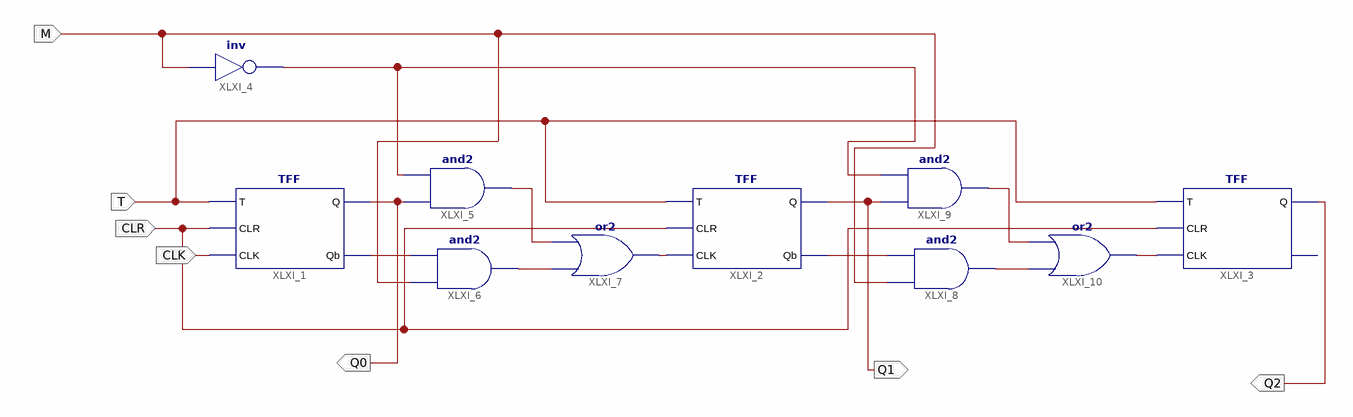
[diagram p0: schematic sheet 1]
// Xilinx ISE schematic Ripple_couner_up_down.sch (spartan3a) as structural Verilog: 10 symbols, 7 ports
module Ripple_couner_up_down (
  input  M,
  input  T,
  input  CLR,
  input  CLK,
  output Q0,
  output Q1,
  output Q2
);

  wire XLXN_5, XLXN_7, XLXN_8, XLXN_9, XLXN_11, XLXN_12, XLXN_13, XLXN_14, XLXN_15;

  TFF XLXI_1 (.T(T), .CLR(CLR), .CLK(CLK), .Q(Q0), .Qb(XLXN_5));
  TFF XLXI_2 (.T(T), .CLR(CLR), .CLK(XLXN_9), .Q(Q1), .Qb(XLXN_11));
  TFF XLXI_3 (.T(T), .CLR(CLR), .CLK(XLXN_14), .Q(Q2));  // open: Qb
  not XLXI_4 (XLXN_15, M);
  and XLXI_5 (XLXN_7, Q0, XLXN_15);
  and XLXI_6 (XLXN_8, M, XLXN_5);
  or XLXI_7 (XLXN_9, XLXN_8, XLXN_7);
  and XLXI_8 (XLXN_13, M, XLXN_11);
  and XLXI_9 (XLXN_12, Q1, XLXN_15);
  or XLXI_10 (XLXN_14, XLXN_13, XLXN_12);
endmodule
